# EAGLE design Zio Qwiic GPS Module (EAGLE 9.1.1)
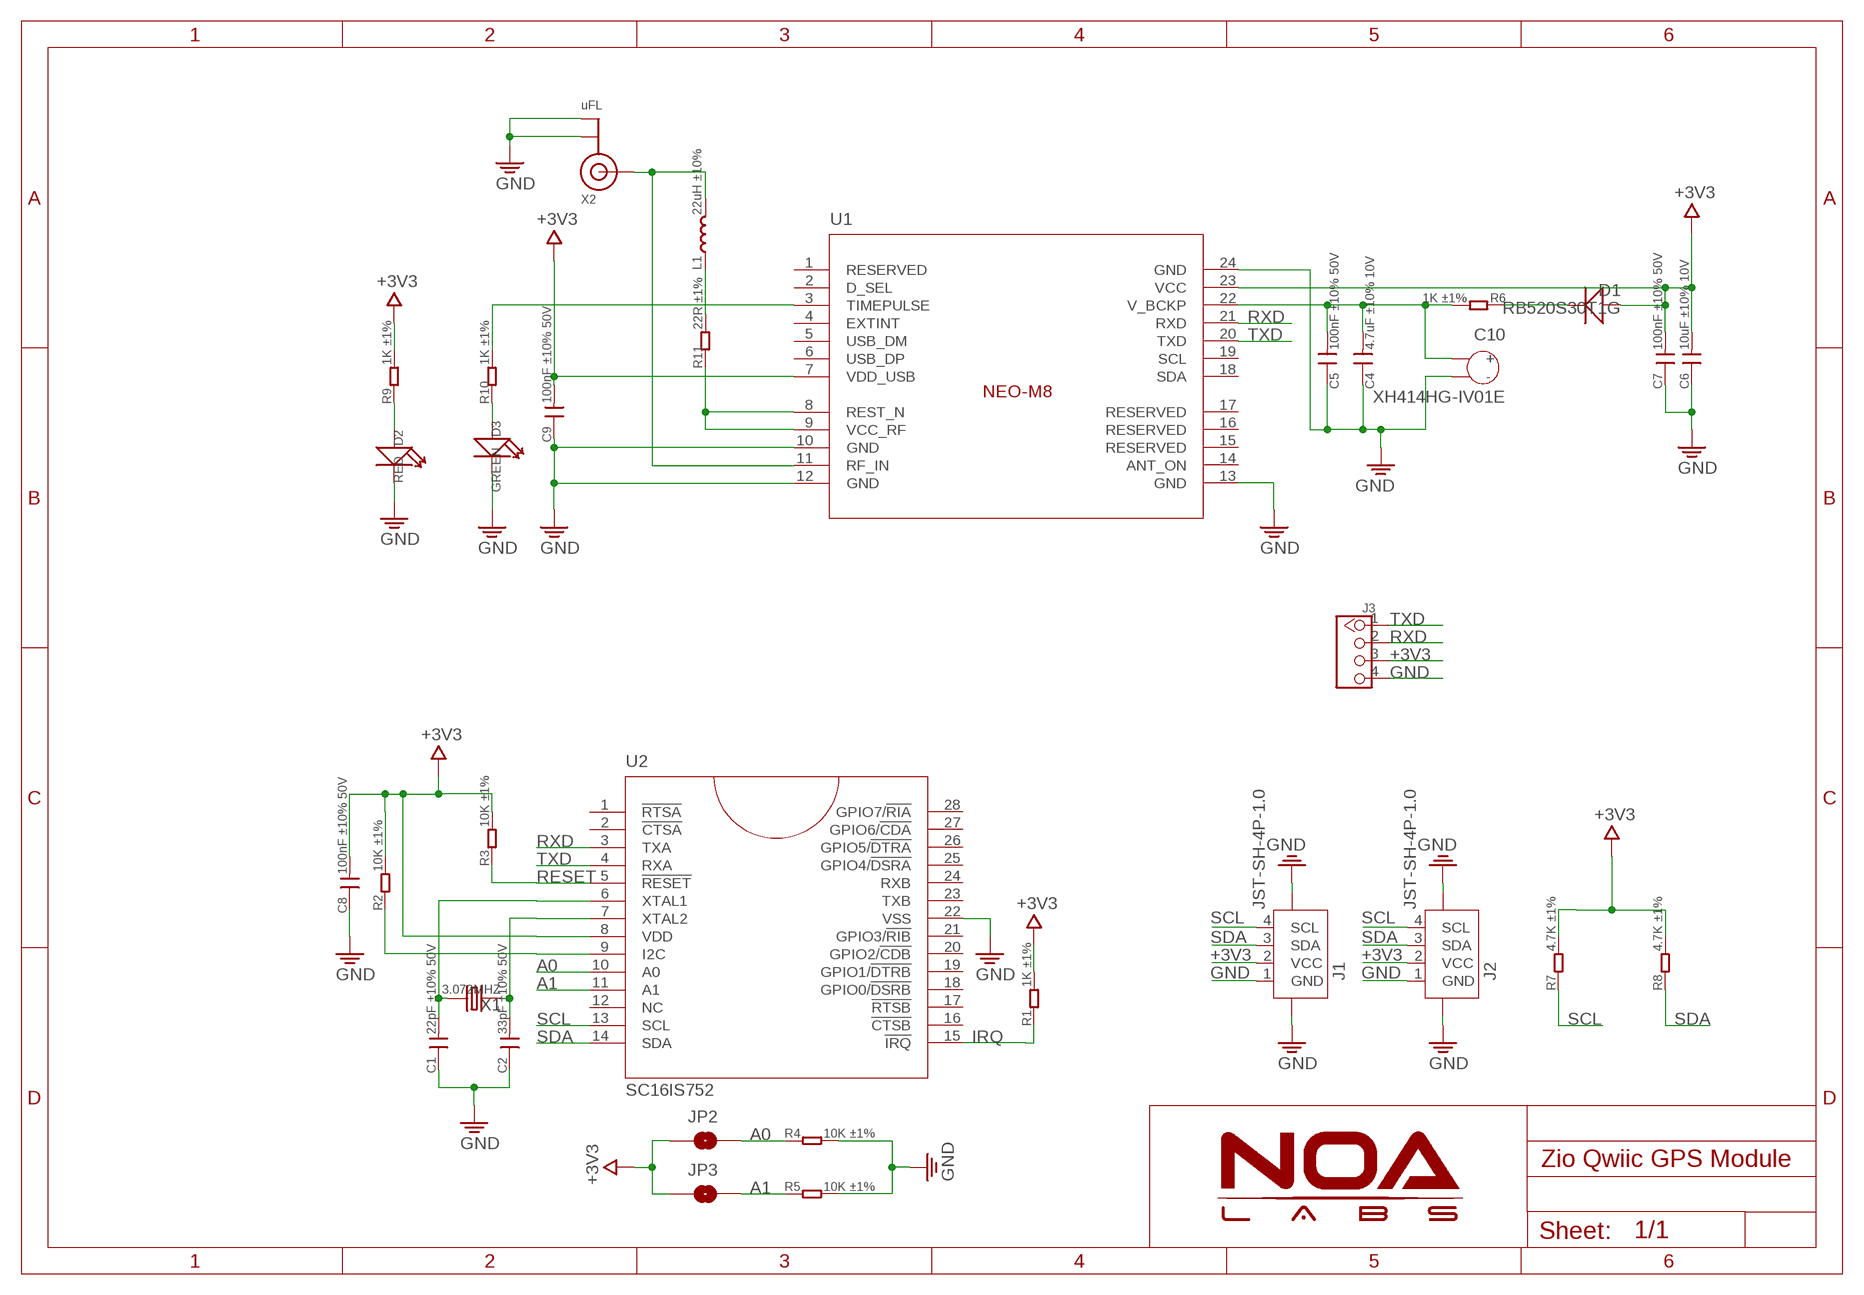
[diagram p0: schematic, sheet 1]

## Parts
C1  22pF ±10% 50V  C-0603  [C0603]
C2  33pF ±10% 50V  C-0603  [C0603]
C4  4.7uF ±10% 10V  C-0603  [C0603]
C5  100nF ±10% 50V  C-0603  [C0603]
C6  10uF ±10% 10V  C-0603  [C0603]
C7  100nF ±10% 50V  C-0603  [C0603]
C8  100nF ±10% 50V  C-0603  [C0603]
C9  100nF ±10% 50V  C-0603  [C0603]
C10  XH414HG-IV01E  [XH414HG-IV01E]
D1  RB520S30T1G  D-0603  [SOD523]
D2  RED  LED'0603'  [LED-0603]
D3  GREEN  LED'0603'  [LED-0603]
J1  JST-SH-4P-1.0  [JST-SH-4P]
J2  JST-SH-4P-1.0  [JST-SH-4P]
J3  HEADER-4P-1.25-SMD  [4PIN_SMD]
JP2  JUMPER-SMT_2_NC_PASTE_NOCREM  [SMT-JUMPER_2_NC_PASTE_SILK_NOCREM]
JP3  JUMPER-SMT_2_NC_PASTE_NOCREM  [SMT-JUMPER_2_NC_PASTE_SILK_NOCREM]
L1  22uH ±10%  L-0603  [L0603]
R1  1K ±1%  R-0603  [R0603]
R2  10K ±1%  R-0603  [R0603]
R3  10K ±1%  R-0603  [R0603]
R4  10K ±1%  R-0603  [R0603]
R5  10K ±1%  R-0603  [R0603]
R6  1K ±1%  R-0603  [R0603]
R7  4.7K ±1%  R-0603  [R0603]
R8  4.7K ±1%  R-0603  [R0603]
R9  1K ±1%  R-0603  [R0603]
R10  1K ±1%  R-0603  [R0603]
R11  22R ±1%  R-0603  [R0603]
U1  NEO-M8N  [NEO-M8N]
U2  SC16IS752  [TSSOP28]
X1  3.072MHZ  CRYSTAL-HC49S  [HC49/S]
X2  uFL  ANTENNA_U.FL  [U.FL]

## Nets
+3V3: C6.2 C7.2 C8.2 C9.2 D1.+ J1.2(VCC) J2.2(VCC) J3.3 JP2.1 JP3.1 R1.2 R2.2 R3.2 R7.2 R8.2 R9.2 U1.7(VDD_USB) U1.23(VCC) U2.8(VDD)
A0: JP2.2 R4.1 U2.10(A0)
A1: JP3.2 R5.1 U2.11(A1)
GND: C1.1 C2.1 C4.1 C5.1 C6.1 C7.1 C8.1 C9.1 C10.- D2.- D3.- J1.1(GND) J1.NC1 J1.NC2 J2.1(GND) J2.NC1 J2.NC2 J3.4 R4.2 R5.2 U1.10(GND) U1.12(GND) U1.13(GND) U1.24(GND) U2.22(VSS) X2.1(GND) X2.2(GND)
IRQ: R1.1 U2.15(!IRQ)
N$1: D1.- R6.1
N$2: D2.+ R9.1
N$3: R10.2 U1.3(TIMEPULSE)
N$4: D3.+ R10.1
N$5: R2.1 U2.9(I2C)
N$6: C4.2 C5.2 C10.+ R6.2 U1.22(V_BCKP)
N$7: C2.2 U2.7(XTAL2) X1.1
N$8: C1.2 U2.6(XTAL1) X1.2
N$9: R11.1 U1.8(REST_N) U1.9(VCC_RF)
N$10: L1.1 R11.2
N$11: L1.2 U1.11(RF_IN) X2.3(SIGNAL)
RESET: R3.1 U2.5(!RESET)
RXD: J3.2 U1.21(RXD) U2.3(TXA)
SCL: J1.4(SCL) J2.4(SCL) R7.1 U2.13(SCL)
SDA: J1.3(SDA) J2.3(SDA) R8.1 U2.14(SDA)
TXD: J3.1 U1.20(TXD) U2.4(RXA)
Unconnected: U1.1(RESERVED) U1.2(D_SEL) U1.4(EXTINT) U1.5(USB_DM) U1.6(USB_DP) U1.14(ANT_ON) U1.15(RESERVED) U1.16(RESERVED) U1.17(RESERVED) U1.18(SDA) U1.19(SCL) U2.1(!RTSA) U2.2(!CTSA) U2.12(NC) U2.16(!CTSB) U2.17(!RTSB) U2.18(GPIO0/!DSRB) U2.19(GPIO1/!DTRB) U2.20(GPIO2/!CDB) U2.21(GPIO3/!RIB) U2.23(TXB) U2.24(RXB) U2.25(GPIO4/!DSRA) U2.26(GPIO5/!DTRA) U2.27(GPIO6/!CDA) U2.28(GPIO7/!RIA)

## Library data of the parts
C1 C2 C4-C9 = RCL:C
C10 = Discretex:XH414HG-IV01E
D1 = Discrete_NOA:D*
D2 D3 = Discrete_NOA:LED*
J1 J2 = Connector:JST-SH-4P
J3 = Connector_NOA:HEADER-4P
JP2 JP3 = NOA-Jumpers:JUMPER-SMT_2_NC_PASTE_NOCREM
L1 = RCL:L
R1-R11 = RCL:R
U1 = Module:NEO-M8N
U2 = IC_NOA:SC16IS752
X1 = Discrete_NOA:CRYSTAL*: CRYSTAL
X2 = microbuilder:ANTENNA_U.FL: U.FL Antenna Connector

## Board
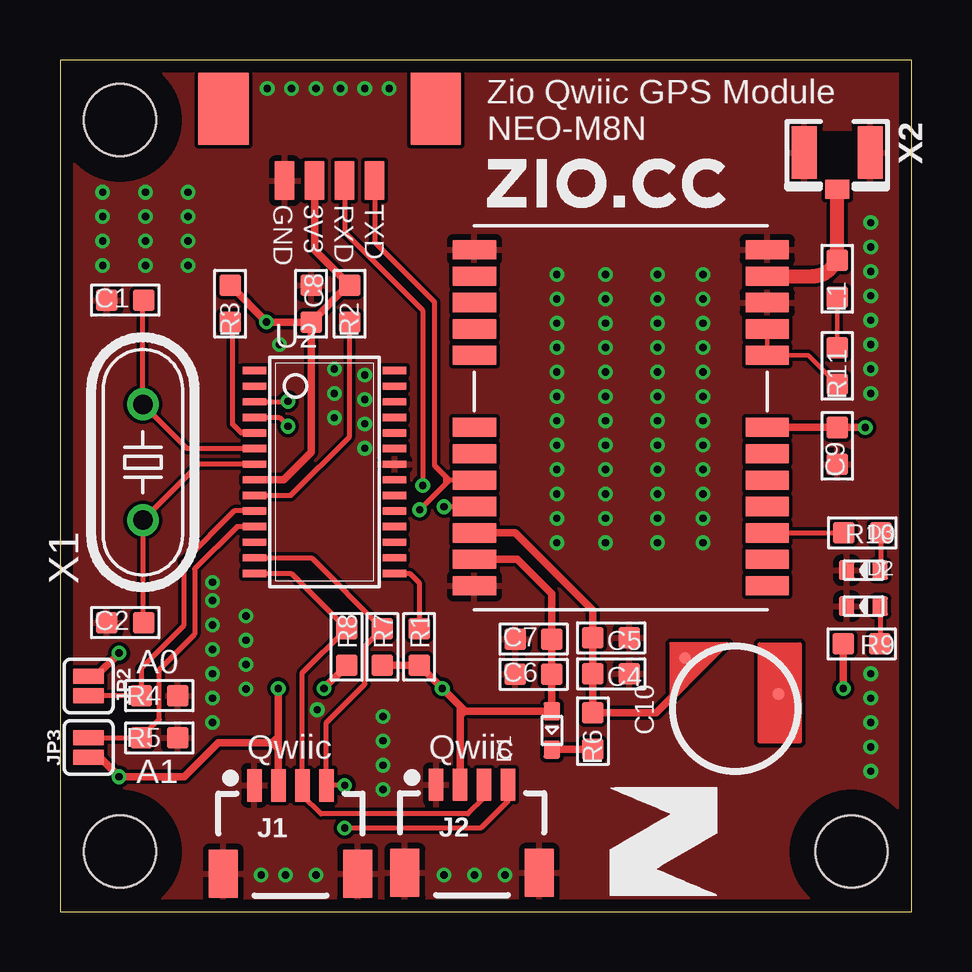
[diagram p1: board, top side]
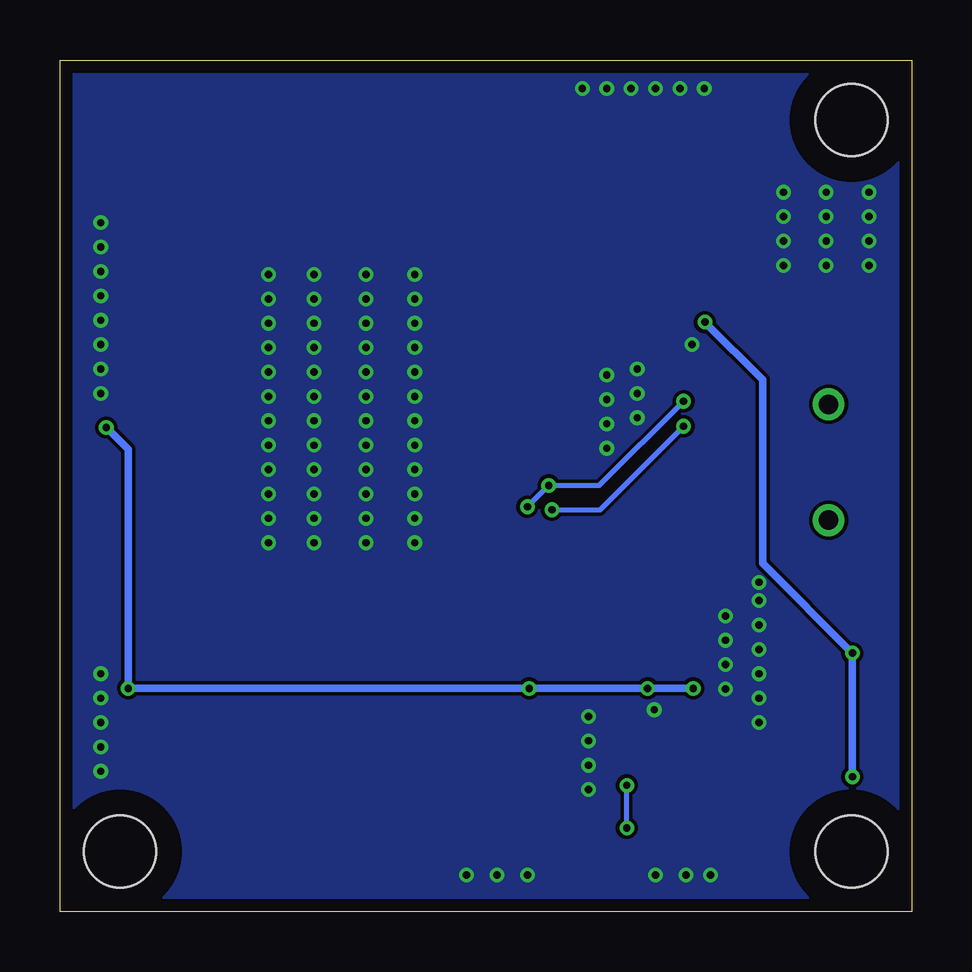
[diagram p2: board, bottom side, seen from below]

Size 35.48 x 35.48 mm. Coordinates in mm from the lower left corner, seen from the top.
Outline: 0,0 35.48,0 35.48,35.48 0,35.48 0,0
Copper layers (1*16): Top 0.035mm / dielectric 1.5mm / Bottom 0.035mm
Design rules "NOA Eagle Rule *": minimum track width 6mil, minimum drill 12mil, track to track 6mil, track to pad 7mil, pad to pad 7mil, via to via 7mil, smd to smd 0mil, copper to edge 20mil, drill to drill 10mil, minimum pad ring 10mil, minimum via ring 6mil, stop-mask expansion 2mil, vias tented up to drill 25mil, thermal gap 10mil
Holes 3 mm at 2.5,32.98 2.5,2.5 32.98,2.5
tRestrict: area 0,30.5 to 5,35.5; area 0,0 to 5,5; area 30.5,0 to 35.5,5
bRestrict: area 0,30.5 to 5,35.5; area 0,0 to 5,5; area 30.5,0 to 35.5,5

### Footprints (pad centres in the part's own frame; a part is rotated, then mirrored left to right if it is on the bottom)
C0603 = smd 0.889 x 0.889: 1 -0.762,0; 2 0.762,0
XH414HG-IV01E = smd 0.5 x 0.5: + 2.1,2.1; - 0.6,-1.8
SOD523 = smd 0.762 x 0.7: + 0.8,0; - -0.8,0
LED-0603 = smd 0.635 x 0.8: + 0.699,0; - -0.699,0
JST-SH-4P = smd 0.6 x 1.35: 1 1.5,0; 2 0.5,0; 3 -0.5,0; 4 -1.5,0 | smd 1.2 x 2: NC1 -2.8,3.675; NC2 2.8,3.675
4PIN_SMD = smd 0.8 x 1.6: 1 0,0; 2 1.25,0; 3 2.5,0; 4 3.75,0 | smd 2.1 x 3: P$5 -2.55,-3; P$6 6.3,-3
SMT-JUMPER_2_NC_PASTE_SILK_NOCREM = smd 0.635 x 1.27: 1 -0.406,0; 2 0.406,0
L0603 = smd 0.889 x 0.889: 1 -0.762,0; 2 0.762,0
R0603 = smd 0.889 x 0.889: 1 -0.762,0; 2 0.762,0
NEO-M8N = smd 1.8 x 0.8: 1 -6.1,7; 2 -6.1,5.9; 3 -6.1,4.8; 4 -6.1,3.7; 5 -6.1,2.6; 6 -6.1,1.5; 7 -6.1,0.4; 8 -6.1,-2.6; 9 -6.1,-3.7; 10 -6.1,-4.8; 11 -6.1,-5.9; 12 -6.1,-7; 13 6.1,-7; 14 6.1,-5.9; 15 6.1,-4.8; 16 6.1,-3.7; 17 6.1,-2.6; 18 6.1,0.4; 19 6.1,1.5; 20 6.1,2.6; 21 6.1,3.7; 22 6.1,4.8; 23 6.1,5.9; 24 6.1,7
TSSOP28 = smd 0.305 x 0.991: 1 -4.225,-2.918; 2 -3.575,-2.918; 3 -2.925,-2.918; 4 -2.275,-2.918; 5 -1.625,-2.918; 6 -0.975,-2.918; 7 -0.325,-2.918; 8 0.325,-2.918; 9 0.975,-2.918; 10 1.625,-2.918; 11 2.275,-2.918; 12 2.925,-2.918; 13 3.575,-2.918; 14 4.225,-2.918; 15 4.225,2.918; 16 3.575,2.918; 17 2.925,2.918; 18 2.275,2.918; 19 1.625,2.918; 20 0.975,2.918; 21 0.325,2.918; 22 -0.325,2.918; 23 -0.975,2.918; 24 -1.625,2.918; 25 -2.275,2.918; 26 -2.925,2.918; 27 -3.575,2.918; 28 -4.225,2.918
HC49/S = drill 0.813: 1 -2.413,0; 2 2.413,0
U.FL = smd 2.2 x 1.05: 1 0,1.375; 2 0,-1.375 | smd 0.8 x 1: 3 1.525,0

### Placement (x,y rotation side)
C1  2.72,25.48 0 top
C2  2.72,12.04 0 top
C4  22.96,9.91 180 top
C5  22.96,11.4 180 top
C6  19.74,9.88 0 top
C7  19.74,11.35 0 top
C8  10.46,25.32 270 top
C9  32.38,19.41 90 top
C10  28.14,8.46 90 top
D1  20.5,7.54 90 top
D2  33.48,12.73 0 top
D3  33.48,14.22 0 top
J1  9.6,5.26 180 top
J2  17.17,5.28 180 top
J3  13.11,30.45 180 top
JP2  1.19,9.4 270 top
JP3  1.19,6.83 90 top
L1  32.38,26.37 90 top
R1  14.96,11.02 270 top
R2  12.06,25.32 90 top
R3  7.09,25.32 90 top
R4  4.14,8.99 0 top
R5  4.14,7.24 0 top
R6  22.2,7.52 90 top
R7  13.44,11.02 270 top
R8  11.94,11.02 270 top
R9  33.4,11.15 180 top
R10  33.43,15.77 180 top
R11  32.38,22.73 90 top
U1  23.37,20.57 180 top
U2  11.02,18.31 270 top
U$7  [7MM]  22.86,0.64 0 top
U$8  [2MM]  17.78,29.34 0 top
X1  3.45,18.72 90 top
X2  32.38,31.62 270 top

### Tracks (layer width: path | path; a pad name or v marks a point on that pad's centre or on a via)
+3V3  (via drill 0.3)
  Top 0.305: U2.8 9.33,17.99 10.46,19.13 C8.2 | C8.2 11.99,26.09 R2.2 10.61,27.54 J3.3 | U1.7 C9.2 v33.55,20.17 | U1.23 19.06,14.67 20.5,13.23 C7.2 C6.2 D1.+ 16.88,8.34 | R7.2 R1.2 v15.93,9.3 16.69,8.53 | 16.69,8.53 16.88,8.34 | J2.2 16.67,8.18 | 16.67,8.18 16.67,8.52 16.69,8.53 | 16.88,8.34 16.84,8.34 16.67,8.18 | J1.2 9.1,6.78 | 9.1,6.78 9.1,7.29 | 9.1,7.29 9.1,9.29 v9.09,9.3 | v11,9.3 11.94,10.24 R8.2 | JP2.1 1.5,9.8 v2.46,10.77 | JP3.1 1.65,6.43 v2.46,5.61 5.18,5.61 6.6,7.04 8.85,7.04 | R3.2 v8.61,24.56 C8.2 | 8.85,7.04 9.1,7.29 | 8.85,7.04 9.1,6.78 | v32.64,9.3 R9.2
  Bottom 0.305: v9.09,9.3 v11,9.3 v15.93,9.3 v32.64,9.3 32.64,19.25 v33.55,20.17 | v2.46,5.61 v2.46,10.77 6.2,14.5 6.2,22.15 v8.61,24.56
A0
  Top 0.203: U2.10 7.26,16.69 5.16,14.58 5.16,11.91 3.38,10.13 R4.1 JP2.2
A1
  Top 0.203: U2.11 7.38,16.04 5.61,14.28 5.61,11.56 4.14,10.08 4.14,8 R5.1 JP3.2
GND  (via drill 0.3)
  other vias: 16,1.52 17.27,1.52 18.54,1.52 10.67,1.52 9.4,1.52 8.38,1.52 13.46,5.08 13.46,6.1 13.46,7.11 13.46,8.13 6.35,7.87 6.35,8.89 6.35,9.91 8.64,34.29 9.65,34.29 10.67,34.29 11.68,34.29 12.7,34.29 13.72,34.29 6.35,10.92 6.35,11.94 6.35,12.95 6.35,13.72 33.78,9.91 33.78,8.89 33.78,7.87 33.78,6.86 33.78,5.84 33.78,21.59 33.78,22.61 33.78,23.62 33.78,24.64 33.78,25.65 33.78,26.67 33.78,27.69 33.78,28.7 26.8,15.37 26.8,16.38 26.8,17.4 26.8,18.41 26.8,19.43 26.8,20.45 26.8,21.46 26.8,22.48 26.8,23.5 26.8,24.51 26.8,25.53 26.8,26.54 1.78,26.92 1.78,27.94 1.78,28.96 1.78,29.97 11.43,20.57 11.43,21.59 11.43,22.61 9.14,23.62 10.72,8.41 12.7,19.3 12.7,20.32 12.7,21.34 12.7,22.35 3.56,26.92 3.56,27.94 3.56,28.96 3.56,29.97 5.33,26.92 5.33,27.94 5.33,28.96 5.33,29.97 20.7,15.37 20.7,16.38 20.7,17.4 20.7,18.41 20.7,19.43 20.7,20.45 20.7,21.46 20.7,22.48 20.7,23.5 20.7,24.51 20.7,25.53 20.7,26.54 22.73,15.37 22.73,16.38 22.73,17.4 22.73,18.41 22.73,19.43 22.73,20.45 22.73,21.46 22.73,22.48 22.73,23.5 22.73,24.51 22.73,25.53 22.73,26.54 24.89,15.37 24.89,16.38 24.89,17.4 24.89,18.41 24.89,19.43 24.89,20.45 24.89,21.46 24.89,22.48 24.89,23.5 24.89,24.51 24.89,25.53 24.89,26.54 7.75,9.27 7.75,10.29 7.75,11.3 7.75,12.32
  pour Bottom: 0,35.48 35.48,35.48 35.48,0 0,0
  pour Top: 0,35.48 35.48,35.48 35.48,0 0,0
IRQ
  Top 0.203: U2.15 14.56,14.09 14.96,13.69 R1.1
N$1
  Top 0.305: R6.1 20.51,6.76 D1.-
N$2
  Top 0.203: D2.+ 34.18,11.16 R9.1
N$3
  Top 0.203: U1.3 R10.2
N$4
  Top 0.203: R10.1 34.19,14.24 D3.+
N$5
  Top 0.203: U2.9 9.62,17.34 12.06,19.79 R2.1
N$6
  Top 0.305: C10.+ 26.04,9.48 24.84,8.28 R6.2 C4.2 C5.2 22.2,12.55 18.97,15.77 U1.22
N$7
  Top 0.203: U2.7 5.79,18.64 X1.1 3.45,12.06 C2.2
N$8
  Top 0.203: U2.6 5.3,19.29 X1.2 3.45,25.45 C1.2
N$9
  Top 0.178: U1.9 U1.8 31.18,23.17 R11.1
N$10
  Top 0.178: R11.2 L1.1
N$11
  Top 0.592: L1.2 32.38,27.48 | 32.38,27.48 X2.3 | U1.11 31.38,26.47 arc90 32.38,27.48
RESET
  Top 0.203: U2.5 7.54,19.94 7.19,20.3 7.19,24.46 R3.1
RXD  (via drill 0.3)
  Top 0.203: v16,16.87 v16.01,16.87 U1.21 | J3.2 11.86,28.3 15.11,25.04 v15.11,17.75 | U2.3 9.48,21.24 v9.5,21.26
  Bottom 0.203: v9.5,21.26 13.01,17.75 v15.11,17.75 v16,16.87
SCL  (via drill 0.3)
  Top 0.203: U2.13 10.48,14.74 R7.1 12.7,11.05 12.7,9.47 11.1,7.88 J1.4 v11.86,5.26 | J2.4 18.67,4.62 17.53,3.48 v11.86,3.48
  Bottom 0.203: v11.86,3.48 v11.86,5.26
SDA
  Top 0.203: U2.14 9.63,14.09 R8.1 10.1,9.95 J1.3 10.1,4.83 10.87,4.06 16.99,4.06 17.67,4.74 J2.3
TXD  (via drill 0.3)
  Top 0.203: v14.99,16.74 15.81,17.57 16.07,17.82 | v9.5,20.22 9.13,20.59 U2.4 | J3.1 13.11,27.89 15.6,25.4 15.6,18.59 16.07,18.12 | 16.07,17.82 16.22,17.97 | 16.22,17.97 | 16.07,18.12 16.22,17.97 | 16.07,17.82 16.07,18.12 | U1.20 16.22,17.97 | 16.22,17.97 16.07,17.82
  Bottom 0.203: v14.99,16.74 12.98,16.74 v9.5,20.22

### Text on the board
tPlace: Zio Qwiic GPS Module / NEO-M8N | GND | 3V3 | RXD | TXD | A0 | Qwiic | Qwiic | A1